# Altium schematic sheet Main.SchDoc
size Tabloid; SheetNumber: 1; SheetTotal: 1; Sheet_Name: Main schematics file; Size: 11x17
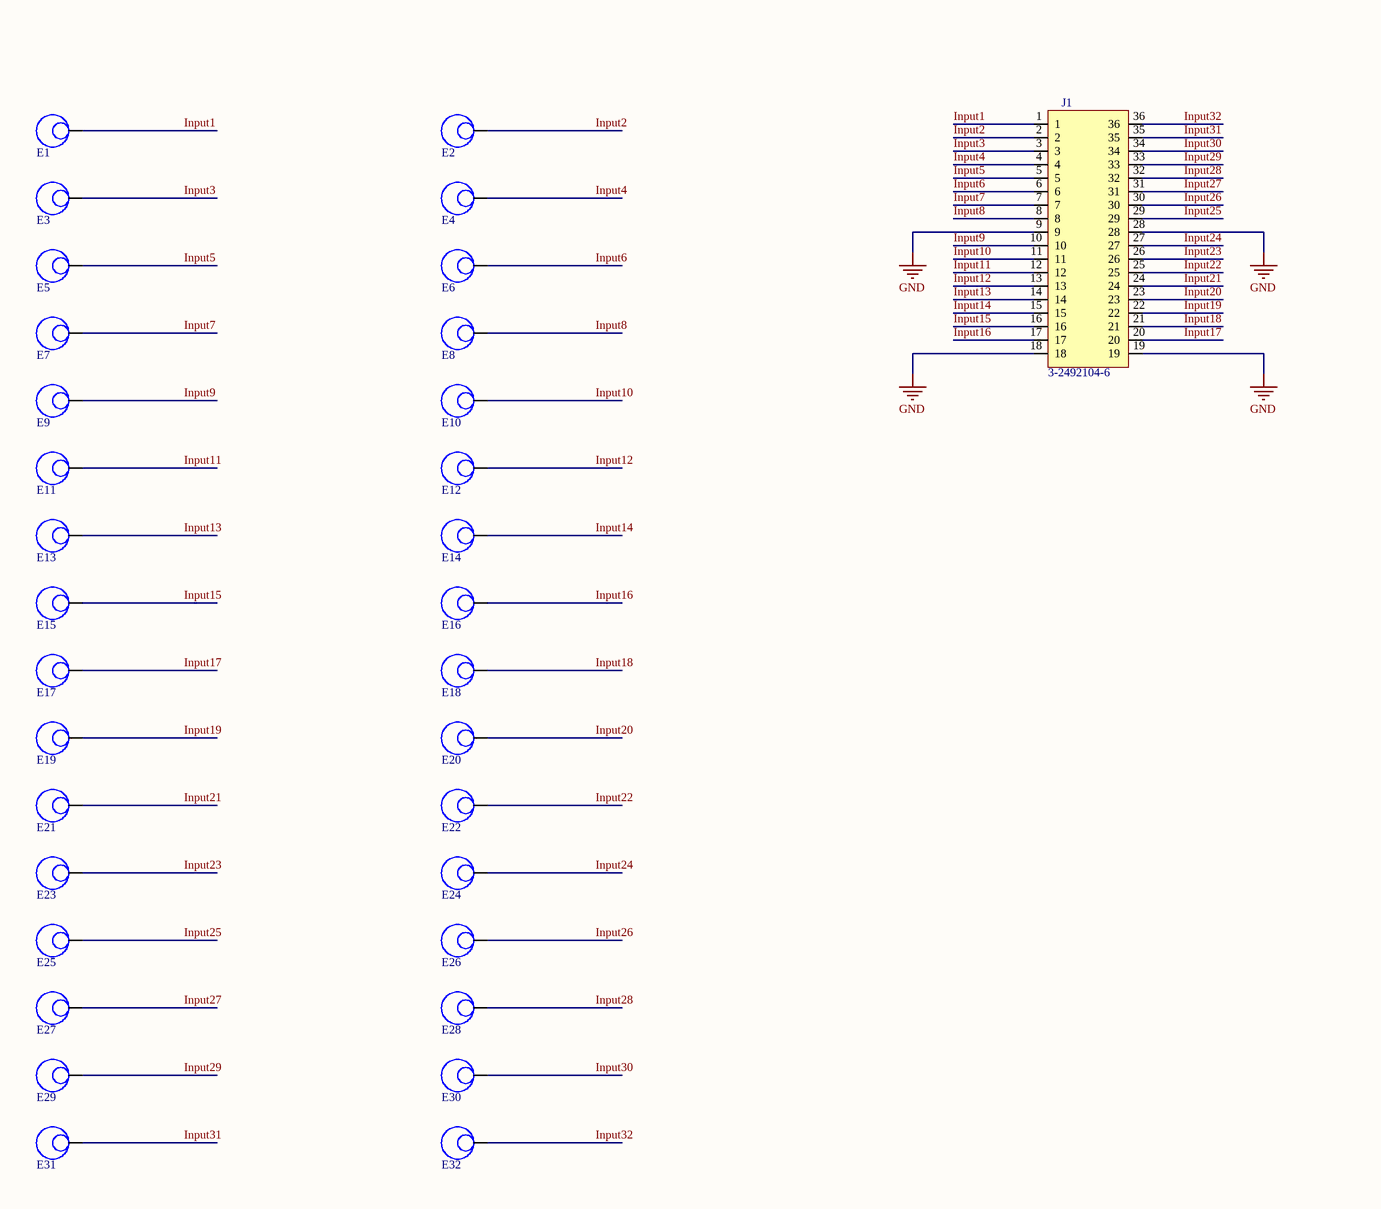
[diagram p0: Main.SchDoc, left]
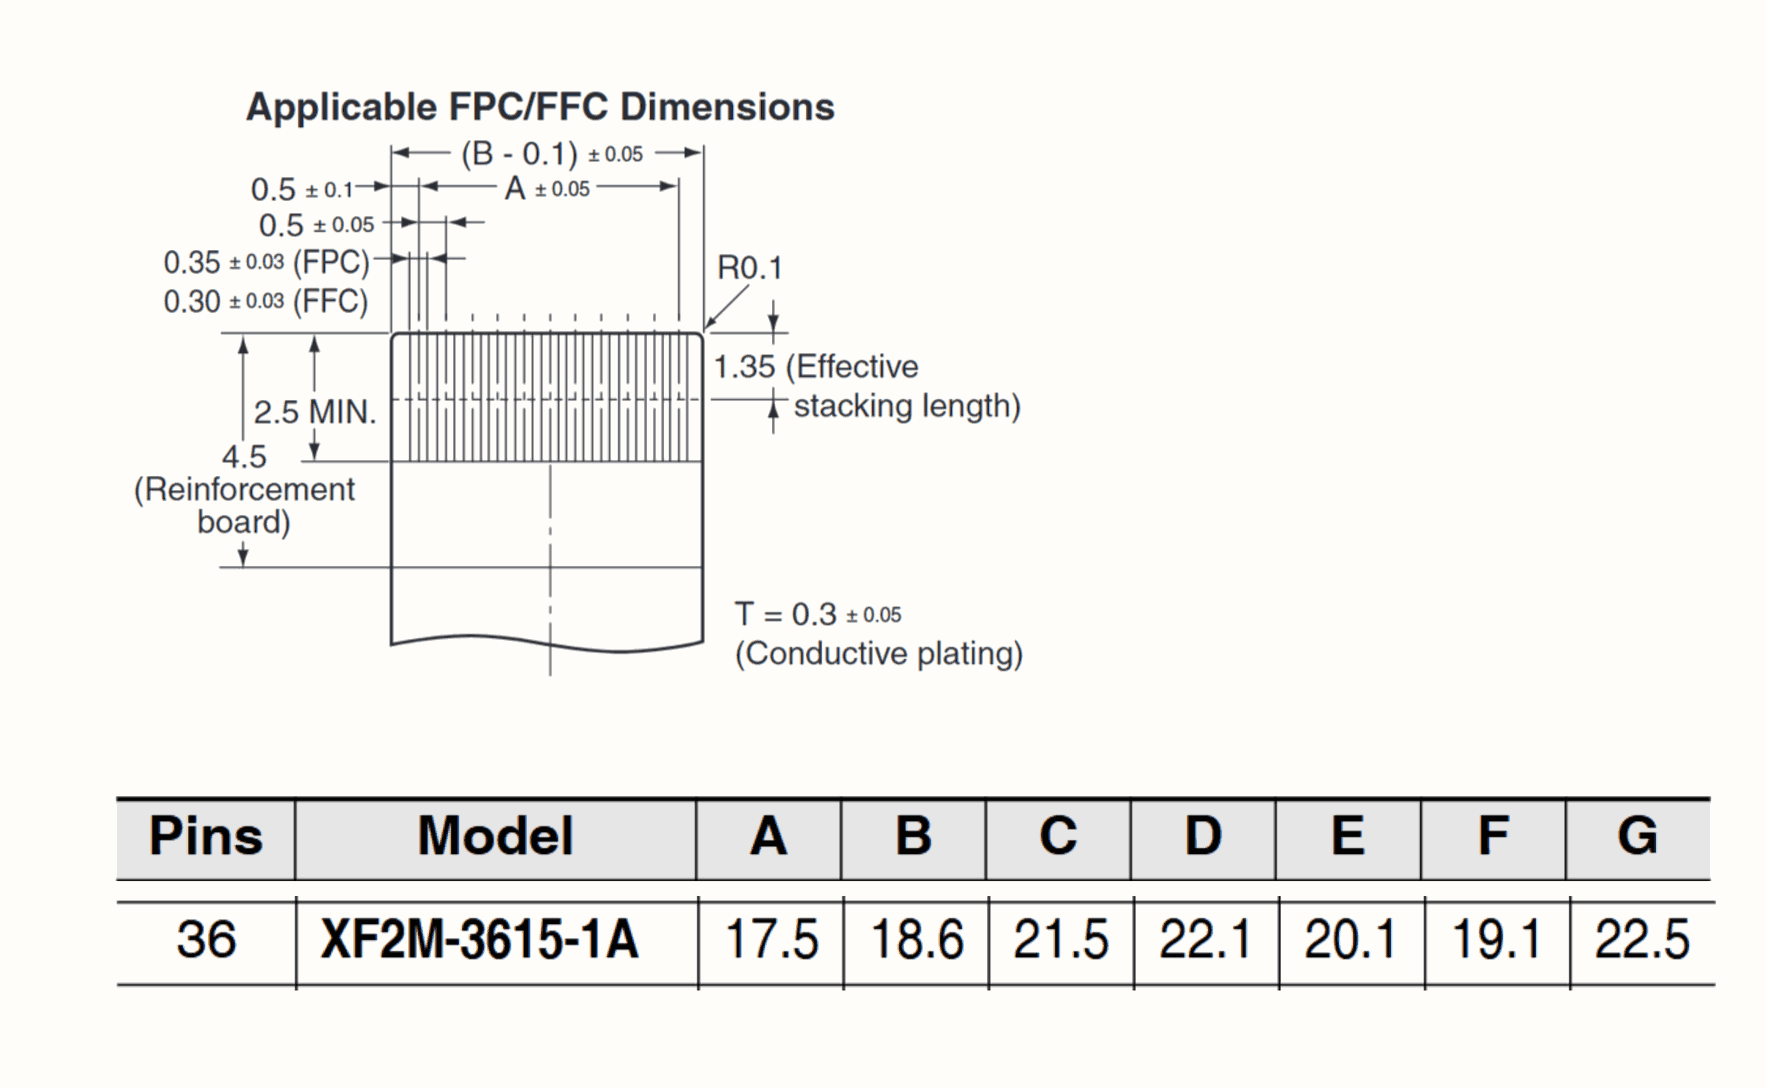
[diagram p1: Main.SchDoc, right]

## Parts
E1  UNeedle  [UNeedle]  (value not drawn)
E2  UNeedle  [UNeedle]  (value not drawn)
E3  UNeedle  [UNeedle]  (value not drawn)
E4  UNeedle  [UNeedle]  (value not drawn)
E5  UNeedle  [UNeedle]  (value not drawn)
E6  UNeedle  [UNeedle]  (value not drawn)
E7  UNeedle  [UNeedle]  (value not drawn)
E8  UNeedle  [UNeedle]  (value not drawn)
E9  UNeedle  [UNeedle]  (value not drawn)
E10  UNeedle  [UNeedle]  (value not drawn)
E11  UNeedle  [UNeedle]  (value not drawn)
E12  UNeedle  [UNeedle]  (value not drawn)
E13  UNeedle  [UNeedle]  (value not drawn)
E14  UNeedle  [UNeedle]  (value not drawn)
E15  UNeedle  [UNeedle]  (value not drawn)
E16  UNeedle  [UNeedle]  (value not drawn)
E17  UNeedle  [UNeedle]  (value not drawn)
E18  UNeedle  [UNeedle]  (value not drawn)
E19  UNeedle  [UNeedle]  (value not drawn)
E20  UNeedle  [UNeedle]  (value not drawn)
E21  UNeedle  [UNeedle]  (value not drawn)
E22  UNeedle  [UNeedle]  (value not drawn)
E23  UNeedle  [UNeedle]  (value not drawn)
E24  UNeedle  [UNeedle]  (value not drawn)
E25  UNeedle  [UNeedle]  (value not drawn)
E26  UNeedle  [UNeedle]  (value not drawn)
E27  UNeedle  [UNeedle]  (value not drawn)
E28  UNeedle  [UNeedle]  (value not drawn)
E29  UNeedle  [UNeedle]  (value not drawn)
E30  UNeedle  [UNeedle]  (value not drawn)
E31  UNeedle  [UNeedle]  (value not drawn)
E32  UNeedle  [UNeedle]  (value not drawn)
J1  3-2492104-6  [Fingers_36POS]

## Nets
GND: J1.9 J1.18 J1.19 J1.28
Input1: E1.1 J1.1
Input2: E2.1 J1.2
Input3: E3.1 J1.3
Input4: E4.1 J1.4
Input5: E5.1 J1.5
Input6: E6.1 J1.6
Input7: E7.1 J1.7
Input8: E8.1 J1.8
Input9: E9.1 J1.10
Input10: E10.1 J1.11
Input11: E11.1 J1.12
Input12: E12.1 J1.13
Input13: E13.1 J1.14
Input14: E14.1 J1.15
Input15: E15.1 J1.16
Input16: E16.1 J1.17
Input17: E17.1 J1.20
Input18: E18.1 J1.21
Input19: E19.1 J1.22
Input20: E20.1 J1.23
Input21: E21.1 J1.24
Input22: E22.1 J1.25
Input23: E23.1 J1.26
Input24: E24.1 J1.27
Input25: E25.1 J1.29
Input26: E26.1 J1.30
Input27: E27.1 J1.31
Input28: E28.1 J1.32
Input29: E29.1 J1.33
Input30: E30.1 J1.34
Input31: E31.1 J1.35
Input32: E32.1 J1.36

## Notes on the sheet
- Sheet Name
- Project Title
- Global Project
- Size
- Group
- Revision
- Date
- Sheet
- of
- Filename
- Designers

## Library data of the parts
J1 = CON_FINGERS_36POS: GRAMS Lib Spec: 2.7